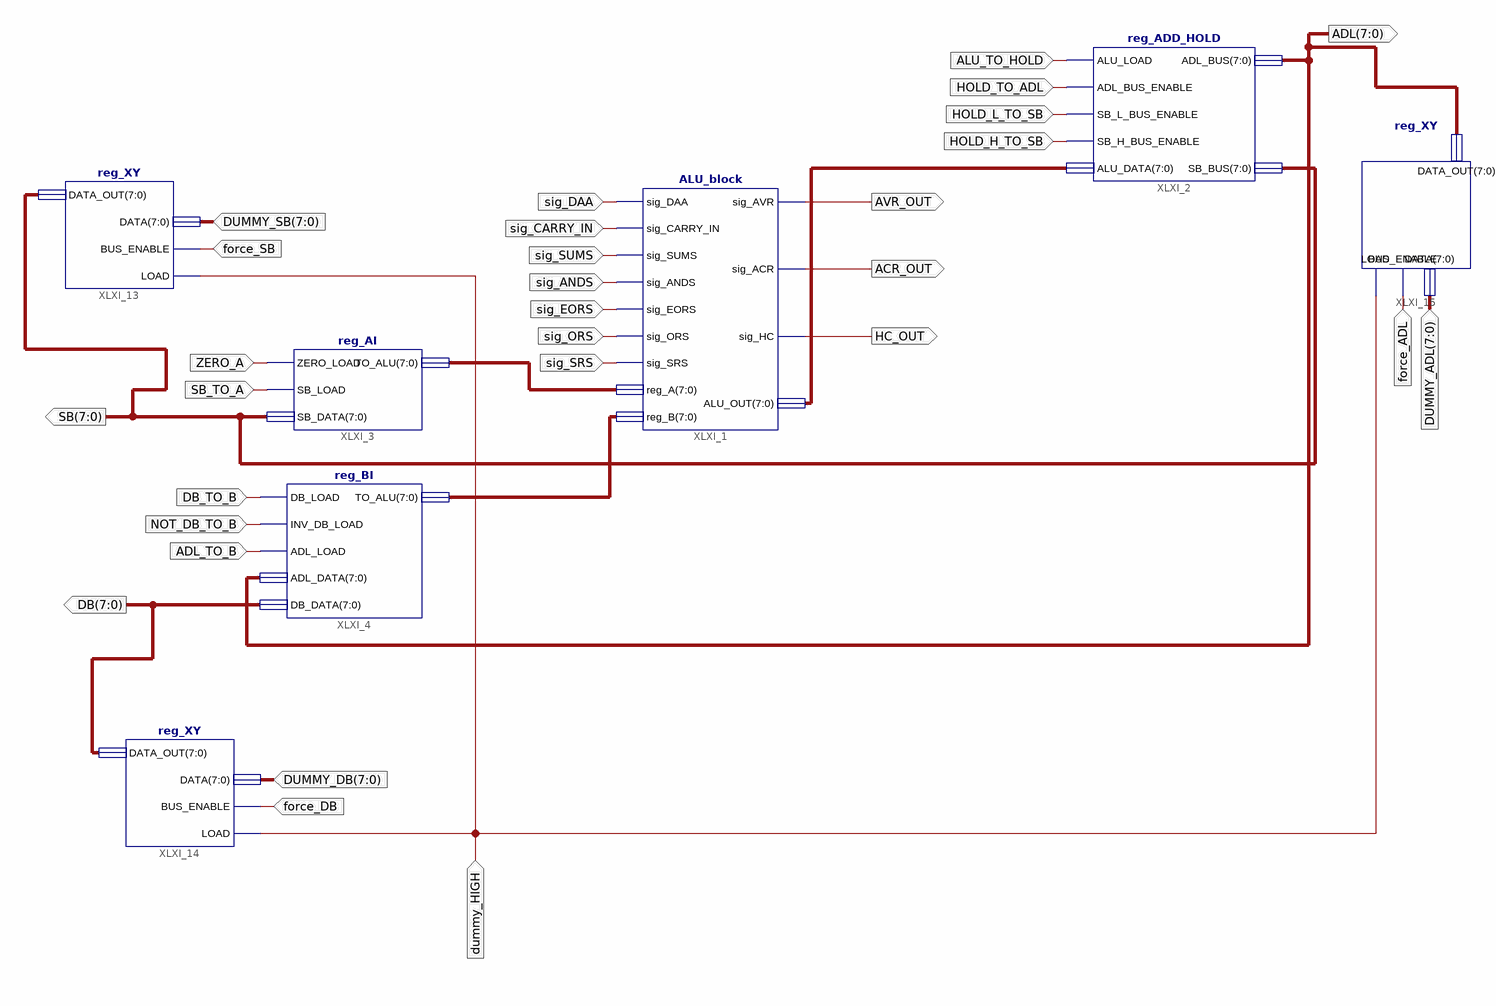
[diagram p0: schematic sheet 1]
// Xilinx ISE schematic ALU_basic_setup.sch (spartan6) as structural Verilog: 7 symbols, 29 ports
module ALU_basic_setup (
  input  SB_TO_A,
  input  DB_TO_B,
  input  NOT_DB_TO_B,
  input  ADL_TO_B,
  input  sig_DAA,
  input  sig_CARRY_IN,
  input  sig_SUMS,
  input  sig_ANDS,
  input  sig_EORS,
  input  sig_ORS,
  input  sig_SRS,
  input  ALU_TO_HOLD,
  input  HOLD_TO_ADL,
  input  HOLD_L_TO_SB,
  input  HOLD_H_TO_SB,
  input  ZERO_A,
  input  dummy_HIGH,
  input  force_DB,
  input  force_SB,
  input  force_ADL,
  input  [7:0] DUMMY_DB,
  input  [7:0] DUMMY_ADL,
  input  [7:0] DUMMY_SB,
  output [7:0] ADL,
  output [7:0] SB,
  output [7:0] DB,
  output AVR_OUT,
  output ACR_OUT,
  output HC_OUT
);

  wire [7:0] XLXN_1, XLXN_2, XLXN_3;

  ALU_block XLXI_1 (
    .sig_DAA(sig_DAA), .sig_CARRY_IN(sig_CARRY_IN), .sig_SUMS(sig_SUMS), .sig_ANDS(sig_ANDS),
    .sig_EORS(sig_EORS), .sig_ORS(sig_ORS), .sig_SRS(sig_SRS), .reg_A(XLXN_1), .reg_B(XLXN_2),
    .sig_AVR(AVR_OUT), .sig_ACR(ACR_OUT), .sig_HC(HC_OUT), .ALU_OUT(XLXN_3));
  reg_ADD_HOLD XLXI_2 (
    .ALU_LOAD(ALU_TO_HOLD), .ADL_BUS_ENABLE(HOLD_TO_ADL), .SB_L_BUS_ENABLE(HOLD_L_TO_SB),
    .SB_H_BUS_ENABLE(HOLD_H_TO_SB), .ALU_DATA(XLXN_3), .ADL_BUS(ADL), .SB_BUS(SB));
  reg_AI XLXI_3 (.ZERO_LOAD(ZERO_A), .SB_LOAD(SB_TO_A), .SB_DATA(SB), .TO_ALU(XLXN_1));
  reg_BI XLXI_4 (
    .DB_LOAD(DB_TO_B), .INV_DB_LOAD(NOT_DB_TO_B), .ADL_LOAD(ADL_TO_B), .ADL_DATA(ADL), .DB_DATA(DB),
    .TO_ALU(XLXN_2));
  reg_XY XLXI_13 (.LOAD(dummy_HIGH), .BUS_ENABLE(force_SB), .DATA(DUMMY_SB), .DATA_OUT(SB));
  reg_XY XLXI_14 (.LOAD(dummy_HIGH), .BUS_ENABLE(force_DB), .DATA(DUMMY_DB), .DATA_OUT(DB));
  reg_XY XLXI_15 (.LOAD(dummy_HIGH), .BUS_ENABLE(force_ADL), .DATA(DUMMY_ADL), .DATA_OUT(ADL));
endmodule
